# EAGLE design arduino-light-strip (EAGLE 9.6.2)
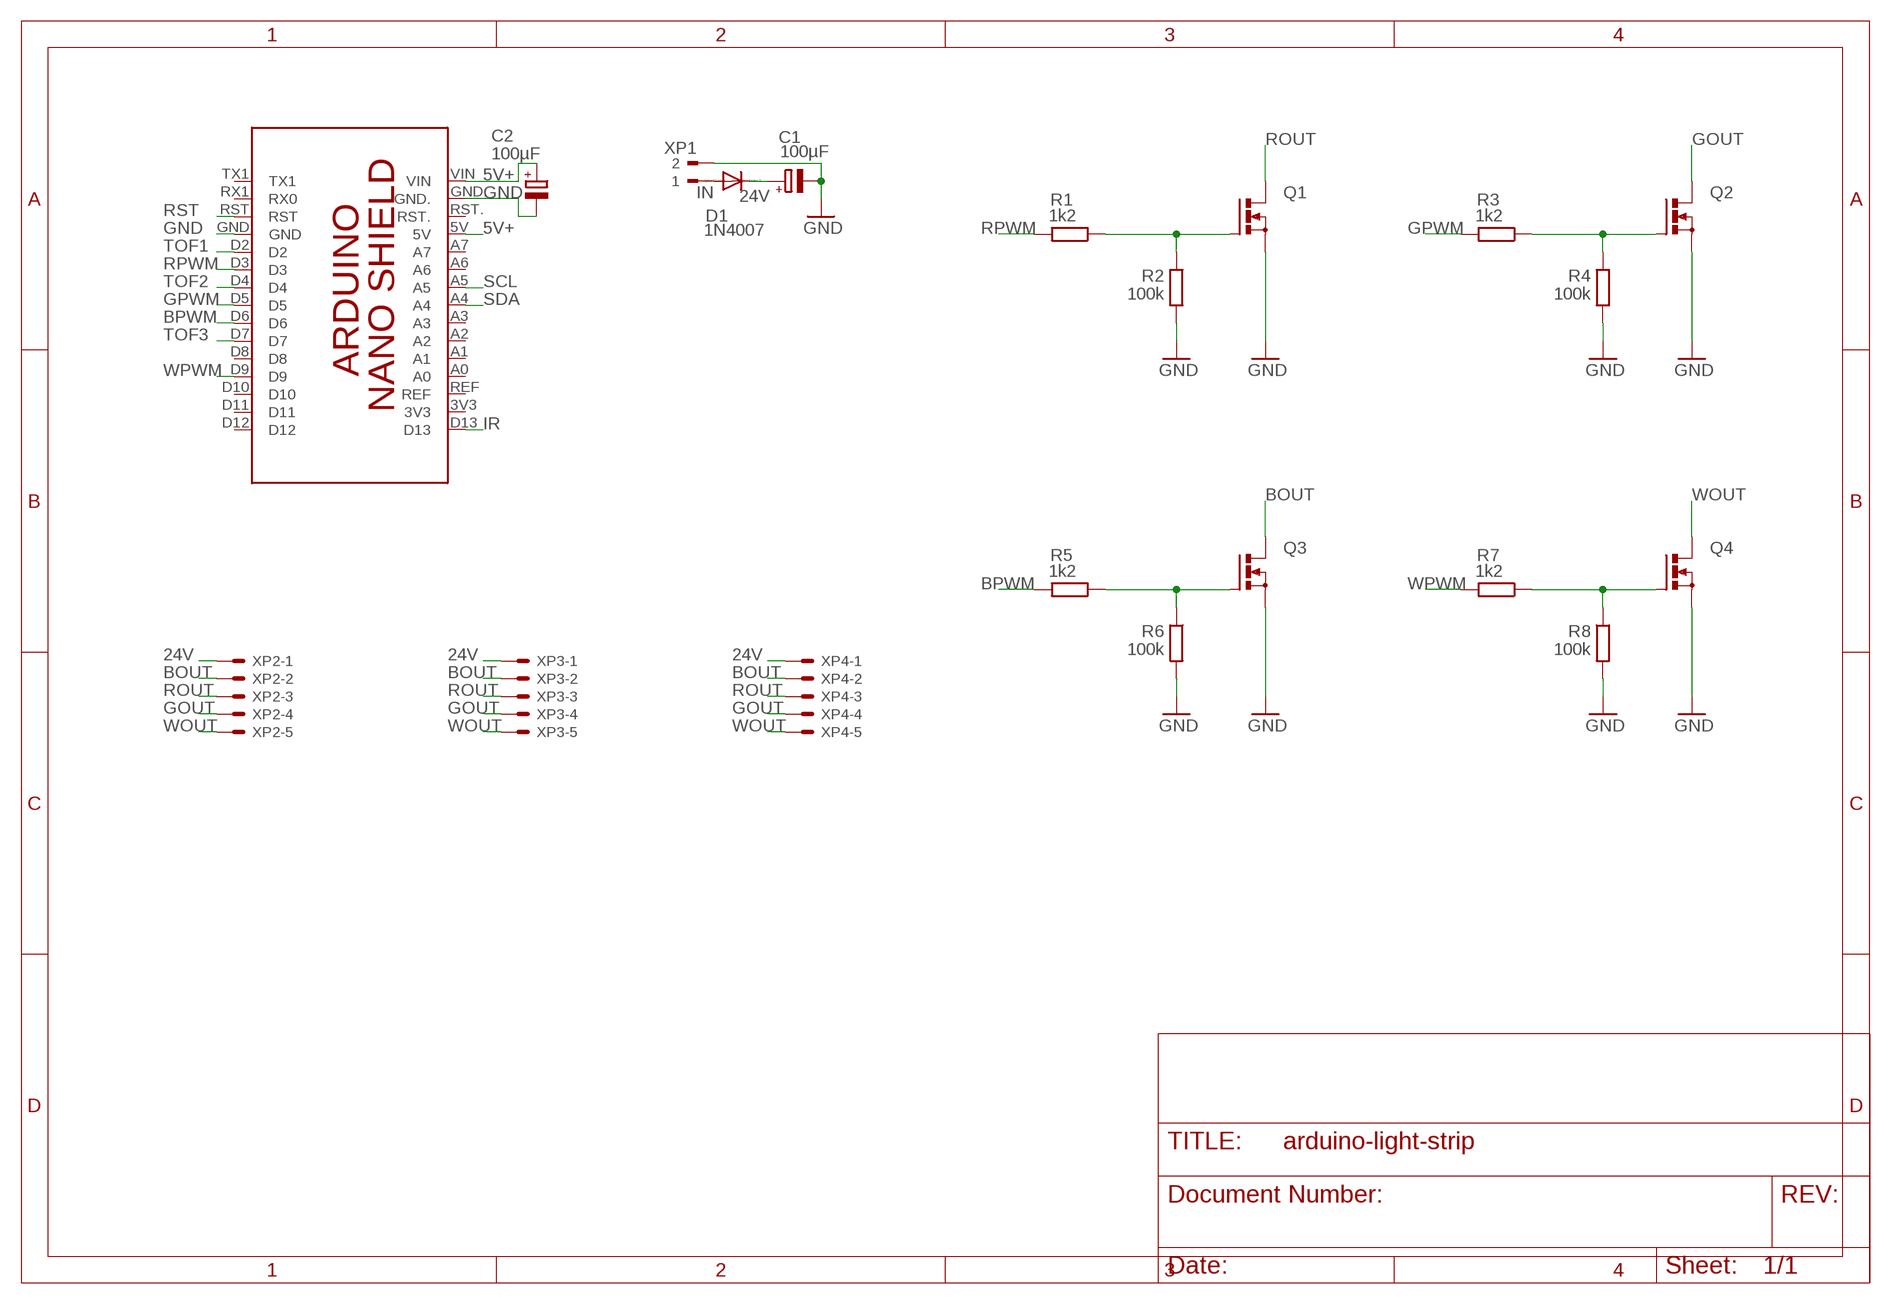
[diagram p0: schematic, sheet 1]

## Parts
C1  100µF  RCL_CPOL-EUE5-6  [RCL_E5-6]
C2  100µF  RCL_CPOL-EUE5-6  [RCL_E5-6]
D1  1N4007  DIODE_DIODE-F126-10  [DIODE_F126-10]
PCB1  0_WSH_FAVORITES_ARDUINO_NANO  [0_WSH_FAVORITES_ARDUINO_NANO]
Q1  0_WSH_FAVORITES_BUZ11BV  [0_WSH_FAVORITES_TO220BV]
Q2  0_WSH_FAVORITES_BUZ11BV  [0_WSH_FAVORITES_TO220BV]
Q3  0_WSH_FAVORITES_BUZ11BV  [0_WSH_FAVORITES_TO220BV]
Q4  0_WSH_FAVORITES_BUZ11BV  [0_WSH_FAVORITES_TO220BV]
R1  1k2  R-EU_R1206  [R1206]
R2  100k  R-EU_R1206  [R1206]
R3  1k2  R-EU_R1206  [R1206]
R4  100k  R-EU_R1206  [R1206]
R5  1k2  R-EU_R1206  [R1206]
R6  100k  R-EU_R1206  [R1206]
R7  1k2  R-EU_R1206  [R1206]
R8  100k  R-EU_R1206  [R1206]
XP1  180-3  CON-WEIDMUELLER-SL35_180-2  [CON-WEIDMUELLER-SL35_180-2]
XP2  22-27-2051-05  [6410-05]
XP3  22-27-2051-05  [6410-05]
XP4  22-27-2051-05  [6410-05]

## Nets
5V+: C2.+ PCB1.5V PCB1.VIN
24V: C1.+ D1.C XP2.1 XP3.1 XP4.1
BOUT: Q3.D XP2.2 XP3.2 XP4.2
BPWM: PCB1.D6 R5.2
GND: C1.- C2.- PCB1.GND PCB1.GND. Q1.S Q2.S Q3.S Q4.S R2.2 R4.2 R6.2 R8.2 XP1.2
GOUT: Q2.D XP2.4 XP3.4 XP4.4
GPWM: PCB1.D5 R3.2
IN: D1.A XP1.1
IR: PCB1.D13
N$1: Q1.G R1.1 R2.1
N$4: Q2.G R3.1 R4.1
N$7: Q3.G R5.1 R6.1
N$10: Q4.G R7.1 R8.1
ROUT: Q1.D XP2.3 XP3.3 XP4.3
RPWM: PCB1.D3 R1.2
RST: PCB1.RST
SCL: PCB1.A5
SDA: PCB1.A4
TOF1: PCB1.D2
TOF2: PCB1.D4
TOF3: PCB1.D7
WOUT: Q4.D XP2.5 XP3.5 XP4.5
WPWM: PCB1.D9 R7.2
Unconnected: PCB1.3V3 PCB1.A0 PCB1.A1 PCB1.A2 PCB1.A3 PCB1.A6 PCB1.A7 PCB1.D8 PCB1.D10 PCB1.D11 PCB1.D12 PCB1.REF PCB1.RST. PCB1.RX1(RX0) PCB1.TX1

## Library data of the parts
C1 C2 = 20221130_WSH_Eagle_Lib:RCL_CPOL-EU: POLARIZED CAPACITOR, European symbol
D1 = 20221130_WSH_Eagle_Lib:DIODE_DIODE-: DIODE
PCB1 = 20221130_WSH_Eagle_Lib:0_WSH_FAVORITES_ARDUINO_NANO: Device for representing an Arduino Nano shield
Q1-Q4 = 20221130_WSH_Eagle_Lib:0_WSH_FAVORITES_BUZ11: N-CHANNEL MOS FET
R1-R8 = resistor:R-EU_: RESISTOR, European symbol
XP1 = 20221130_WSH_Eagle_Lib:CON-WEIDMUELLER-SL35_180-2: WEIDMUELLER CLAMP CONNECTOR; OC_FARNELL: unknown; OC_NEWARK: unknown
XP2-XP4 = con-molex:22-?-05: CONNECTOR wire to board 2.54 mm (.1 inch) pitch header; MF: MOLEX; OC_FARNELL: unknown; OC_NEWARK: unknown

## Board
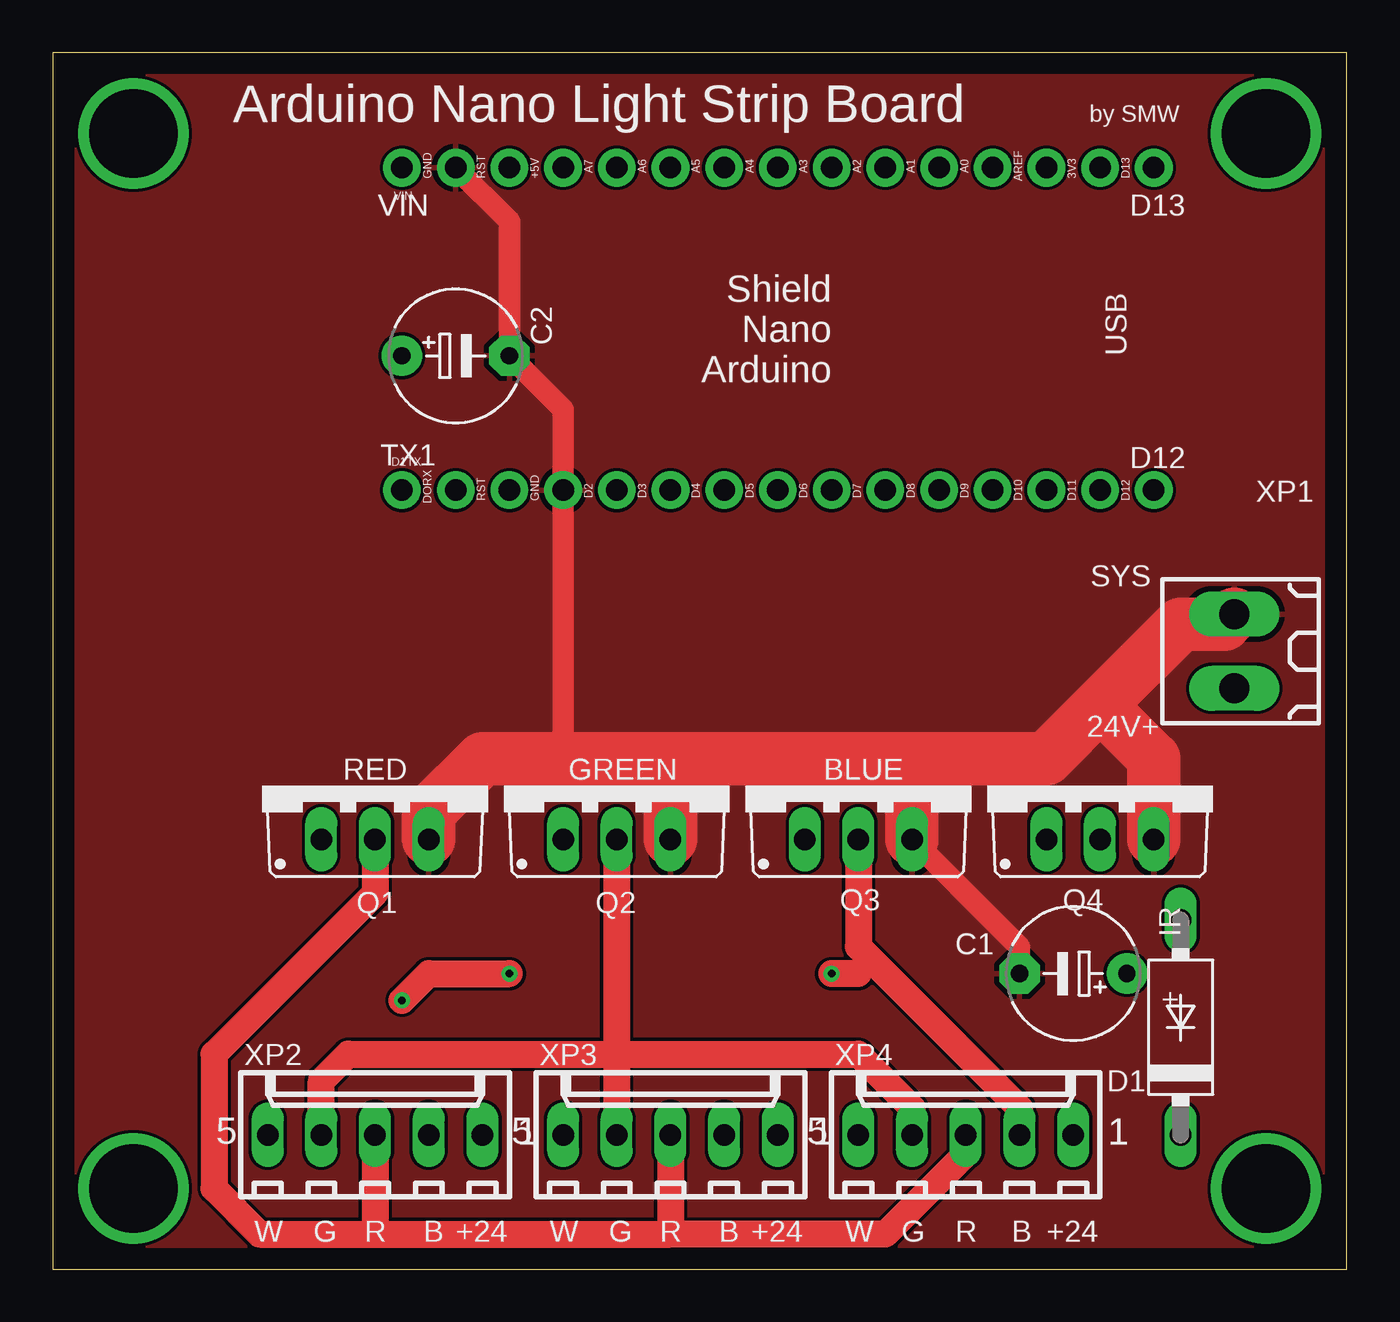
[diagram p1: board, top side]
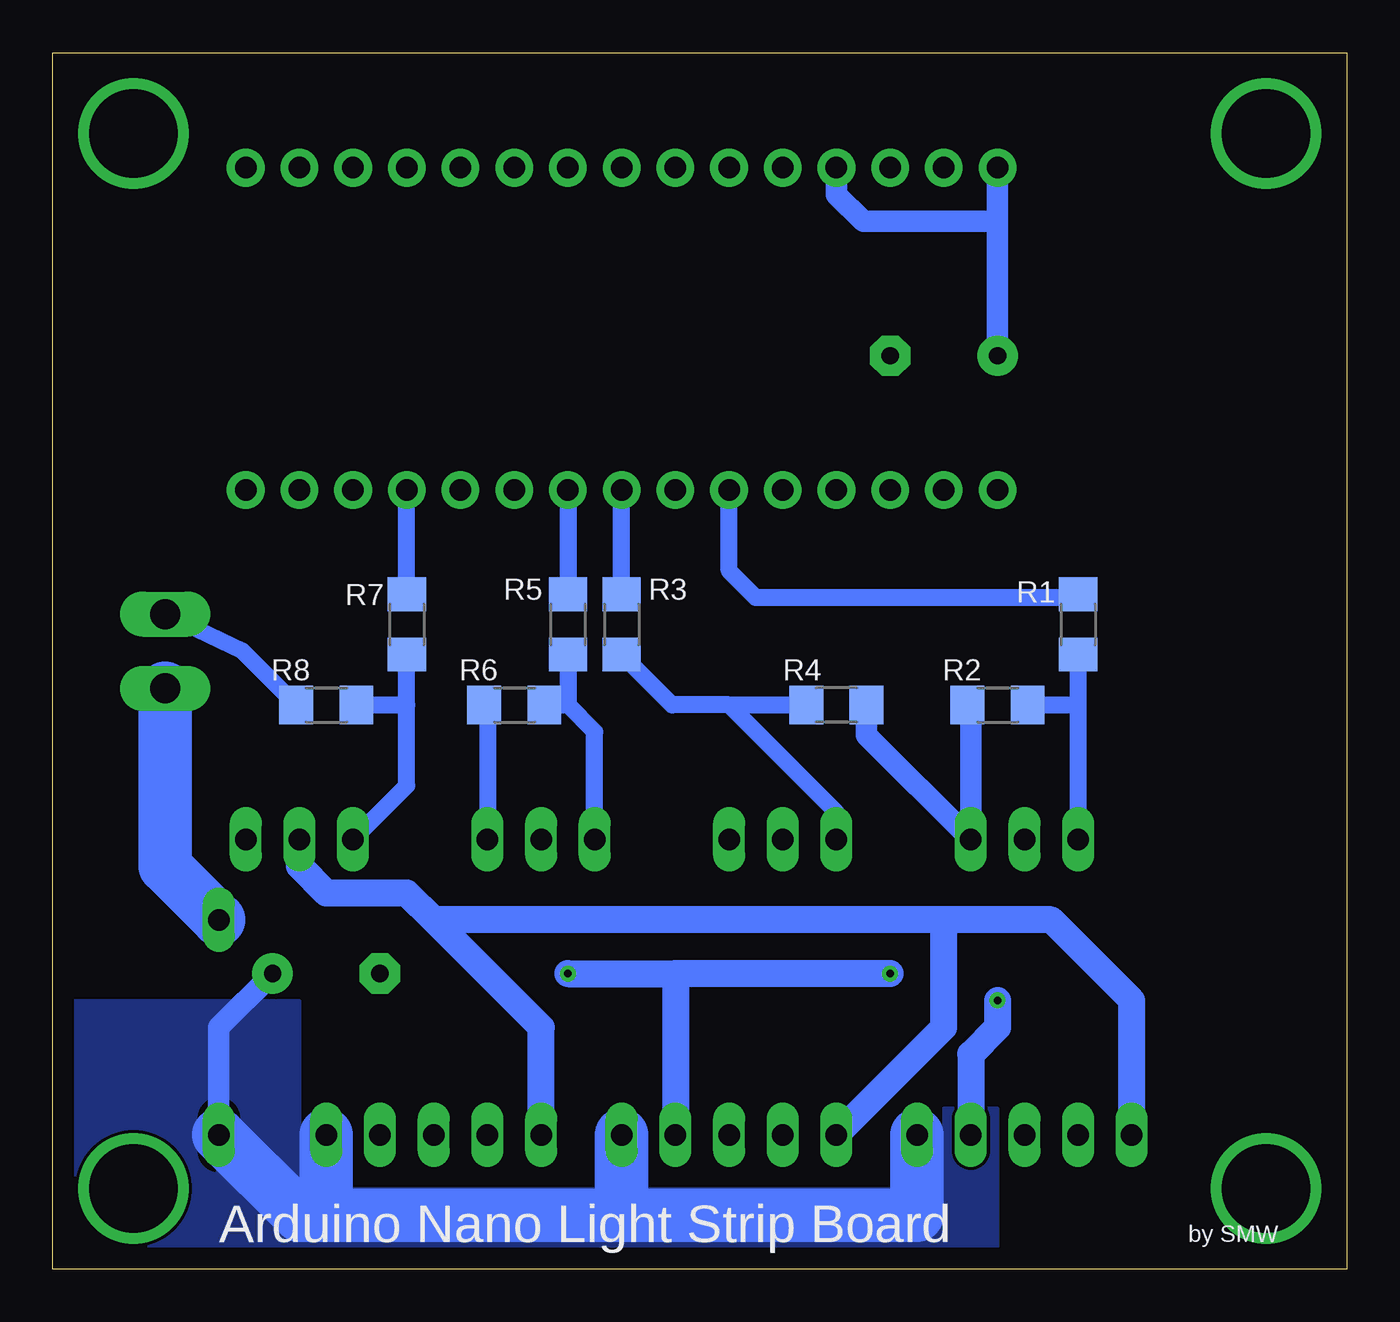
[diagram p2: board, bottom side, seen from below]

Size 61.19 x 57.5 mm. Coordinates in mm from the lower left corner, seen from the top.
Outline: 0,0 61.19,0 61.19,57.5 0,57.5 0,0
Copper layers (1*16): Top 0.035mm / dielectric 1.5mm / Bottom 0.035mm
Design rules "default": minimum track width 6mil, minimum drill 0.35mm, track to track 6mil, track to pad 6mil, pad to pad 6mil, via to via 6mil, smd to smd 6mil, copper to edge 40mil, drill to drill 6mil, minimum pad ring 10mil, minimum via ring 8mil, stop-mask expansion 4mil, vias tented up to drill 0mil, thermal gap 10mil

### Footprints (pad centres in the part's own frame; a part is rotated, then mirrored left to right if it is on the bottom)
RCL_E5-6 = drill 0.813 pad 1.905: + -2.54,0 | drill 0.813 pad 1.905 octagon: - 2.54,0
DIODE_F126-10 = drill 1.016 long: A 5.08,0; C -5.08,0
0_WSH_FAVORITES_ARDUINO_NANO = drill 1.016 pad 1.778: 3V3 6.35,1.27; 5V 31.75,1.27; A0 11.43,1.27; A1 13.97,1.27; A2 16.51,1.27; A3 19.05,1.27; A4 21.59,1.27; A5 24.13,1.27; A6 26.67,1.27; A7 29.21,1.27; D2 29.21,16.51; D3 26.67,16.51; D4 24.13,16.51; D5 21.59,16.51; D6 19.05,16.51; D7 16.51,16.51; D8 13.97,16.51; D9 11.43,16.51; D10 8.89,16.51; D11 6.35,16.51; D12 3.81,16.51; D13 3.81,1.27; GND 31.75,16.51; GND. 36.83,1.27; REF 8.89,1.27; RST 34.29,16.51; RST. 34.29,1.27; RX1 36.83,16.51; TX1 39.37,16.51; VIN 39.37,1.27
0_WSH_FAVORITES_TO220BV = drill 1.016 long: D 0,-2.54; G -2.54,-2.54; S 2.54,-2.54
R1206 = smd 1.6 x 1.803: 1 -1.422,0; 2 1.422,0
CON-WEIDMUELLER-SL35_180-2 = drill 1.422 long: 1 -1.75,0; 2 1.75,0
6410-05 = drill 1.016 long: 1 5.08,0; 2 2.54,0; 3 0,0; 4 -2.54,0; 5 -5.08,0

### Placement (x,y rotation side)
C1  48.26,13.97 180 top
C2  19.05,43.18 0 top
D1  53.34,11.43 90 top
PCB1  55.88,53.34 180 top
Q1  15.24,22.86 0 top
Q2  26.67,22.86 0 top
Q3  38.1,22.86 0 top
Q4  49.53,22.86 0 top
R1  12.7,30.48 90 bottom
R2  16.51,26.67 180 bottom
R3  34.29,30.48 90 bottom
R4  24.13,26.67 0 bottom
R5  36.83,30.48 90 bottom
R6  39.37,26.67 180 bottom
R7  44.45,30.48 90 bottom
R8  48.26,26.67 180 bottom
XP1  55.88,29.21 90 top
XP2  15.24,6.35 0 top
XP3  29.21,6.35 0 top
XP4  43.18,6.35 0 top

### Tracks (layer width: path | path; a pad name or v marks a point on that pad's centre or on a via)
5V+
  Bottom 1.016: PCB1.5V 24.13,50.8 22.86,49.53 16.51,49.53 | PCB1.VIN 16.51,49.53 | 16.51,49.53 C2.+
24V
  Bottom 1.016: C1.+ 53.34,11.43 D1.C
  Bottom 2.54: XP4.1 48.26,2.54 | 34.29,2.54 48.26,2.54 | 34.29,2.54 20.32,2.54 XP2.1 | XP3.1 34.29,2.54 | 48.26,2.54 49.53,2.54 D1.C
  pour Bottom: 16.51,0 60.96,0 60.96,12.7 49.53,12.7 49.53,3.81 19.05,3.81 19.05,7.62 16.51,7.62
BOUT  (via drill 0.35)
  Top 1.27: Q3.D 38.1,15.24 45.72,7.62 XP4.2 | v16.51,12.7 17.78,13.97 v21.59,13.97 | 38.1,13.97 v36.83,13.97
  Bottom 1.27: v16.51,12.7 16.51,11.43 17.78,10.16 XP2.2 | v21.59,13.97 31.75,13.97 | 31.75,13.97 XP3.2 | v36.83,13.97 31.75,13.97
BPWM
  Bottom 0.813: PCB1.D6 R5.2
GND
  Top 1.016: Q3.S 45.72,15.24 C1.- | PCB1.GND. 21.59,49.53 C2.- 24.13,40.64 PCB1.GND 24.13,24.13
  Top 2.54: 29.21,24.13 40.64,24.13 | Q3.S 40.64,24.13 | Q2.S 29.21,24.13 | Q4.S 52.07,24.13 49.53,26.67 | 29.21,24.13 24.13,24.13 20.32,24.13 17.78,21.59 Q1.S | XP1.2 55.4,30.48 53.34,30.48 49.53,26.67 | 49.53,26.67 46.99,24.13 40.64,24.13
  Bottom 0.61: R6.2 40.64,26.52
  Bottom 0.813: R8.2 52.22,29.21 XP1.2 | 40.64,26.52 Q3.S
  Bottom 1.016: R2.2 17.78,26.52 Q1.S 22.71,25.25 R4.2
  pour Top: 0.13,0 0.13,57.4 61.21,57.4 61.21,0.13 61.34,0
GOUT
  Top 1.27: 26.67,10.16 13.97,10.16 12.7,8.89 XP2.4 | 26.67,10.16 XP3.4 | 26.67,10.16 38.1,10.16 40.64,7.62 XP4.4 | Q2.D 26.67,10.16
GPWM
  Bottom 0.813: R3.2 PCB1.D5
IN
  Bottom 2.54: D1.A 55.88,19.05 XP1.1
N$1
  Bottom 0.813: Q1.G 12.7,26.67 | 12.7,26.67 R1.1 | R2.1 12.7,26.67
N$3  (via drill 4.2 pad 5)
  other vias: 3.81,53.69
N$4
  Bottom 0.813: Q2.G 24.13,21.59 29.21,26.67 | 29.21,26.67 R4.1 | R3.1 31.9,26.67 29.21,26.67
N$5  (via drill 4.2 pad 5)
  other vias: 57.38,3.81
N$6  (via drill 4.2 pad 5)
  other vias: 3.81,3.81
N$7
  Bottom 0.813: Q3.G 35.56,25.4 36.83,26.67 | R6.1 36.83,26.67 | R5.1 36.83,26.67
N$8  (via drill 4.2 pad 5)
  other vias: 57.38,53.69
N$10
  Bottom 0.813: Q4.G 44.45,22.86 44.45,26.67 | 44.45,26.67 R7.1 | R8.1 44.45,26.67
ROUT
  Top 1.27: Q1.D 15.24,17.78 7.62,10.16 7.62,3.81 9.78,1.65 15.24,1.65 | 15.24,1.65 29.21,1.65 | XP3.3 29.21,1.65 | XP2.3 15.24,1.65 | 29.21,1.65 39.37,1.65 43.18,5.46 XP4.3
RPWM
  Bottom 0.61: R1.2 12.85,31.75
  Bottom 0.813: 12.85,31.75 27.94,31.75 29.21,33.02 PCB1.D3
WOUT
  Bottom 1.27: XP2.5 10.16,12.7 13.97,16.51 19.05,16.51 | XP3.5 19.05,11.43 19.05,16.51 | Q4.D 49.53,19.05 48.26,17.78 44.45,17.78 43.18,16.51 | 19.05,16.51 43.18,16.51 | XP4.5 38.1,11.43 43.18,16.51
WPWM
  Bottom 0.813: R7.2 PCB1.D9

### Text on the board
tNames: Arduino Nano Light Strip Board | by SMW | VIN | VIN | D13 | USB | TX1 | D12 | SYS | 24V+ | RED | GREEN | BLUE | IR | + | - | W | G | R | B | +24 | W | G | R | B | +24 | W | G | R | B | +24
bNames: by SMW | Arduino Nano Light Strip Board